# Altium schematic sheet [07] - RS485.SchDoc
size A
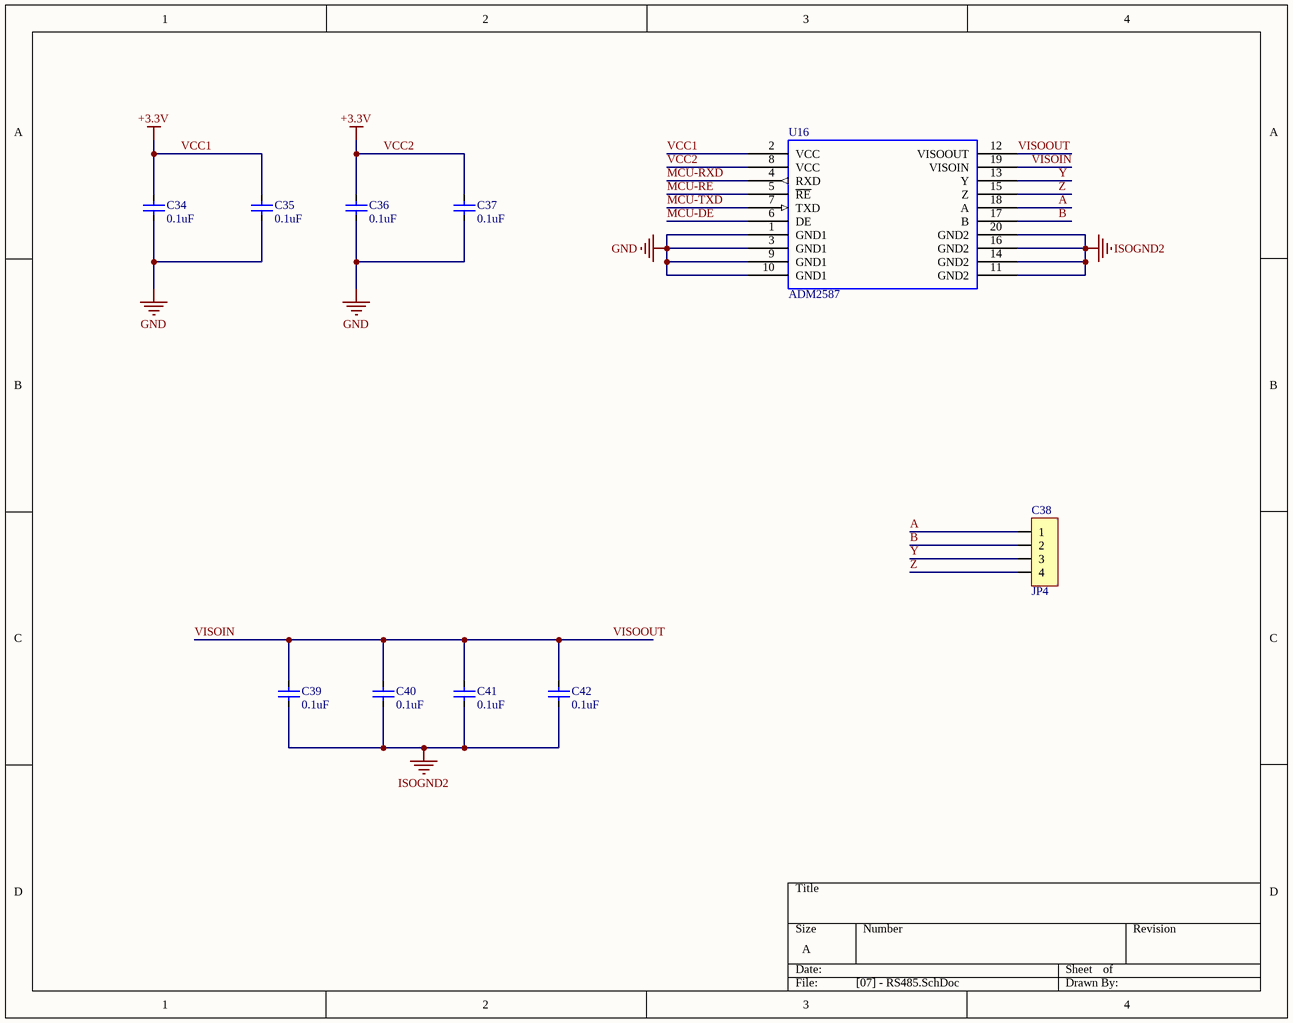
[diagram p0: [07] - RS485.SchDoc]

## Parts
C34  0.1uF  [CAP_0402]
C35  0.1uF  [CAP_0402]
C36  0.1uF  [CAP_0402]
C37  0.1uF  [CAP_0402]
C38  JP4  [JP4-C1T]
C39  0.1uF  [CAP_0402]
C40  0.1uF  [CAP_0402]
C41  0.1uF  [CAP_0402]
C42  0.1uF  [CAP_0402]
U16  ADM2587  [ADM2587]

## Nets
GND: C34.1 C35.1 C36.1 C37.1 U16.1(GND1) U16.3(GND1) U16.9(GND1) U16.10(GND1)
ISOGND2: C39.1 C40.1 C41.1 C42.1 U16.11(GND2) U16.14(GND2) U16.16(GND2) U16.20(GND2)
VCC1: C34.2 C35.2 C36.2 C37.2 U16.2(VCC) U16.8(VCC)  [also labelled +3.3V, VCC2]
A: C38.1 U16.18(A)
B: C38.2 U16.17(B)
MCU-DE: U16.6(DE)
MCU-RE: U16.5(~{RE})
MCU-RXD: U16.4(RXD)
MCU-TXD: U16.7(TXD)
VISOIN: C39.2 C40.2 C41.2 C42.2 U16.12(VISOOUT) U16.19(VISOIN)  [also labelled VISOOUT]
Y: C38.3 U16.13(Y)
Z: C38.4 U16.15(Z)

## Library data of the parts
C34-C37 C39-C42 = CapSMD: Capacitor; Value: 33p; Published: 8-Jun-2000; LatestRevisionDate: 17-Jul-2002; LatestRevisionNote: Re-released for DXP Platform.; PackageReference: RAD-0.3; Publisher: Altium Limited
C38 = JP4: WR-PHD 2.54 mm Angled Socket Header; Manufacturer: W¨¹rth Elektronik eiSos GmbH; partNo: 613004143121; ComponentLink1 Description: Manufacturer; ComponentLink2 Description: Datasheet; NoPins: 04; Created Date: 29 March 2013; ComponentLink1URL: http://www.we-online.com; ComponentLink2URL: http://katalog.we-online.de/em/datasheet/6130xx143121.pdf; Created by: Karrer Zheng